# Altium schematic sheet 263-15.2.SchDoc
size A4; SheetNumber: 1; SheetTotal: 1
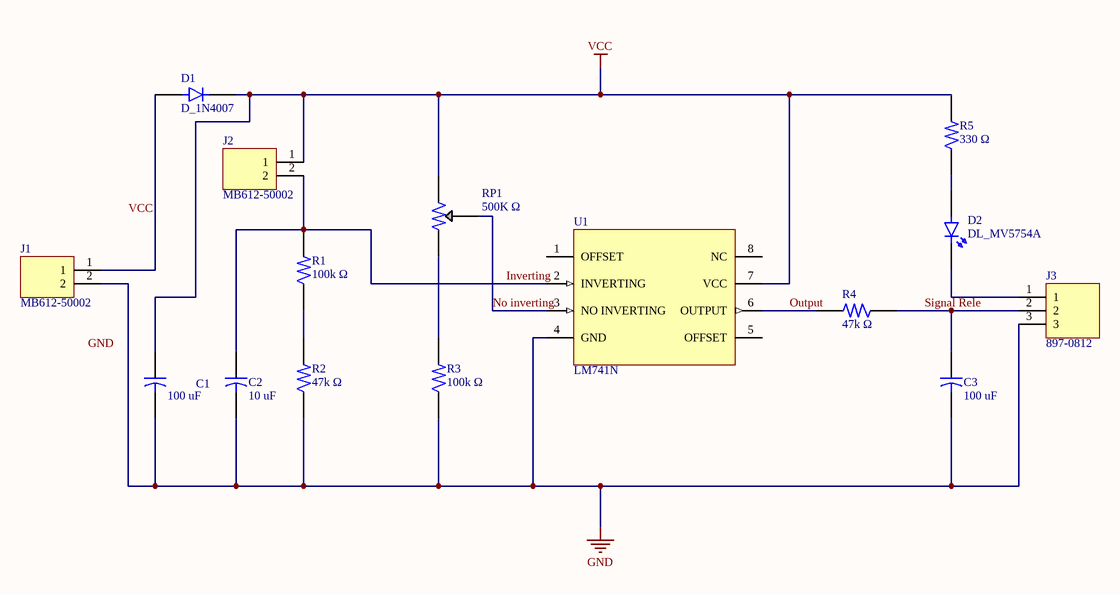
[diagram p0: 263-15.2.SchDoc]

## Parts
C1  value 100 uF  [CAP_2mm]  (hidden comment: CAP_100uF_16V)
C2  value 10 uF  [CAP_1.5mm]  (hidden comment: CAP_10uF_16V)
C3  value 100 uF  [CAP_2mm]  (hidden comment: CAP_100uF_16V)
D1  D_1N4007  [DO-41]
D2  DL_MV5754A  [LED-2.54mm]
J1  MPN: MB612-50002  [CON_2_5mm]  (hidden comment: CON_F_2_MB612-50002)
J2  MPN: MB612-50002  [CON_2_5mm]  (hidden comment: CON_F_2_MB612-50002)
J3  MPN: 897-0812  [CON_3_5mm]  (hidden comment: CON_F_3_897-0812)
R1  value 100k Ω  [RESISTOR-8mm]  (hidden comment: R_100K_THC_0.25W)
R2  value 47k Ω  [RESISTOR-8mm]  (hidden comment: R_47K_THC_0.25W)
R3  value 100k Ω  [RESISTOR-8mm]  (hidden comment: R_100K_THC_0.25W)
R4  value 47k Ω  [RESISTOR-8mm]  (hidden comment: R_47K_THC_0.25W)
R5  value 330 Ω  [RESISTOR-8mm]  (hidden comment: R_330_THC_0.25W)
RP1  value 500K Ω  [RP_RKT6V]  (hidden comment: RP_RKT6V-H)
U1  MPN: LM741N  [PDIP-8_THC]  (hidden comment: IC_LM741)

## Nets
GND: C1.2 C2.2 C3.2 J1.2 J3.3 R2.1 R3.1 U1.4(GND)
VCC: C1.1 D1.K J2.1 R5.2 RP1.1 U1.7(VCC)
Inverting: C2.1 J2.2 R1.2 U1.2(INVERTING)
No inverting: RP1.2 U1.3(NO_INVERTING)
Output: R4.2 U1.6(OUTPUT)
Signal Rele: C3.1 J3.2 R4.1
NetD1_A: D1.A J1.1
NetD2_A: D2.A R5.1
NetD2_K: D2.K J3.1
NetR1_1: R1.1 R2.2
NetR3_2: R3.2 RP1.3

Not connected (* = marked no-connect by the designer): U1 1(OFFSET) 5(OFFSET) 8(NC)

## Notes on the sheet
- Labels drawn without touching a wire or pin: GND, VCC

## Library data of the parts
C1 C3 = CAP_100uF_16V: Capacitor; Published: 23-Sep-2002; PackageReference: CAPR5-4X5; Publisher: Altium Limited; PackageDescription: Capacitor; 2 Leads
C2 = CAP_10uF_16V: Capacitor; Published: 23-Sep-2002; PackageReference: CAPR5-4X5; Publisher: Altium Limited; PackageDescription: Capacitor; 2 Leads
D1 = D_1N4007: Diode Standard 1000 V 1A Through Hole DO-41; Voltage Forward: *; Max Voltage Reverse: *; Max Nominal Current: *; Current peak reverse: *; Min Temperature: *; Max Temperature: *; MPN: *; Max Power dissipated: *; Package: *; SMD/THC: *
D2 = DL_MV5754A: Diode Led Red; Voltage Forward: 2 V; Max Voltage Reverse: 5 V; Max Nominal Current: 20 mA; Min Temperature: -40 ºC; Max Temperature: 100 ºC; Max Power dissipated: 80 mW; SMD/THC: THC; Current peak reverse: *; MPN: MV5754A; Package: *
U1 = IC_LM741: Min Temperature: -65 ºC; Max Temperature: 150 ºC
R1 R3 = R_100K_THC_0.25W: Temperature Min: °C; Temperature Max: °C
R2 R4 = R_47K_THC_0.25W: Temperature Min: °C; Temperature Max: °C
R5 = R_330_THC_0.25W: Temperature Min: °C; Temperature Max: °C
RP1 = RP_RKT6V-H: Temperature Min: °C; Temperature Max: °C; MPN: RKT6V-H